# EAGLE design relaycard (EAGLE 6.2)
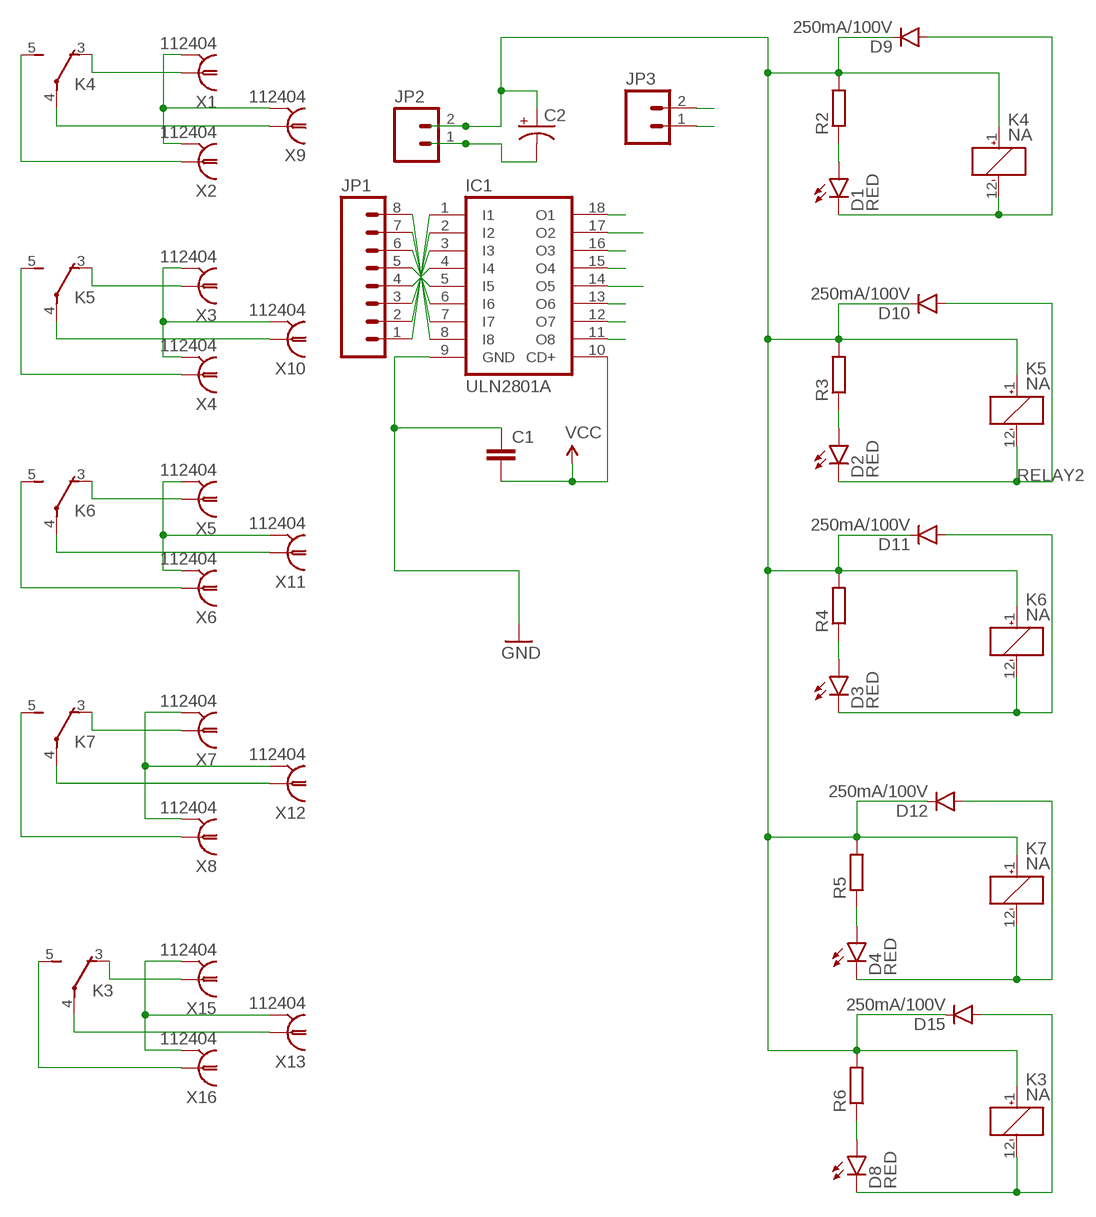
[diagram p0: schematic, sheet 1]

## Parts
C1  0.1UF-50V-20%(PTH)KIT-EZ  [CAP-PTH-SMALL-KIT]
C2  100UF-25V-20%(PTH)  [CPOL-RADIAL-100UF-25V]
D1  RED  LED-RED1206  [LED-1206]
D2  RED  LED-RED1206  [LED-1206]
D3  RED  LED-RED1206  [LED-1206]
D4  RED  LED-RED1206  [LED-1206]
D8  RED  LED-RED1206  [LED-1206]
D9  250mA/100V  DIODEBAS16  [SOD-323]
D10  250mA/100V  DIODEBAS16  [SOD-323]
D11  250mA/100V  DIODEBAS16  [SOD-323]
D12  250mA/100V  DIODEBAS16  [SOD-323]
D15  250mA/100V  DIODEBAS16  [SOD-323]
IC1  ULN2801A  [DIL18]
JP1  M08  [1X08_ROUND]
JP2  M02PTH  [1X02]
JP3  M02PTH  [1X02]
K3  NA  [NA]
K4  NA  [NA]
K5  NA  [NA]
K6  NA  [NA]
K7  NA  [NA]
R2  R-EU_R1206W  [R1206W]
R3  R-EU_R1206W  [R1206W]
R4  R-EU_R1206W  [R1206W]
R5  R-EU_R1206W  [R1206W]
R6  R-EU_R1206W  [R1206W]
X1  112404  [112404]
X2  112404  [112404]
X3  112404  [112404]
X4  112404  [112404]
X5  112404  [112404]
X6  112404  [112404]
X7  112404  [112404]
X8  112404  [112404]
X9  112404  [112404]
X10  112404  [112404]
X11  112404  [112404]
X12  112404  [112404]
X13  112404  [112404]
X15  112404  [112404]
X16  112404  [112404]

## Nets
A: D1.A R2.1
B: D2.A R3.1
C: D3.A R4.1
D: D4.A R5.1
E: D8.A R6.1
GND1: X1.2 X1.3 X1.4 X1.5 X2.2 X2.3 X2.4 X2.5 X9.2 X9.3 X9.4 X9.5
GND2: X3.2 X3.3 X3.4 X3.5 X4.2 X4.3 X4.4 X4.5 X10.2 X10.3 X10.4 X10.5
GND3: X5.2 X5.3 X5.4 X5.5 X6.2 X6.3 X6.4 X6.5 X11.2 X11.3 X11.4 X11.5
GND4: X7.2 X7.3 X7.4 X7.5 X8.2 X8.3 X8.4 X8.5 X12.2 X12.3 X12.4 X12.5
GND5: X13.2 X13.3 X13.4 X13.5 X15.2 X15.3 X15.4 X15.5 X16.2 X16.3 X16.4 X16.5
GND_V: C1.1 C2.2(-) IC1.9(GND) JP2.1 JP3.1 JP3.2 ; supply symbol labelled GND
N$1: K4.5(2:S) X2.1
N$2: IC1.1(I1) JP1.1
N$3: K4.3(2:O) X1.1
N$4: K4.4(2:P) X9.1
N$5: K5.5(2:S) X4.1
N$6: IC1.2(I2) JP1.2
N$7: K5.3(2:O) X3.1
N$8: IC1.3(I3) JP1.3
N$9: IC1.4(I4) JP1.4
N$10: IC1.5(I5) JP1.5
N$11: IC1.6(I6) JP1.6
N$12: IC1.7(I7) JP1.7
N$13: K5.4(2:P) X10.1
N$14: K6.3(2:O) X5.1
N$15: K6.5(2:S) X6.1
N$16: K6.4(2:P) X11.1
N$17: K7.3(2:O) X7.1
N$18: IC1.8(I8) JP1.8
N$19: K7.5(2:S) X8.1
N$20: K7.4(2:P) X12.1
N$21: K3.3(2:O) X15.1
N$22: K3.5(2:S) X16.1
N$23: K3.4(2:P) X13.1
RELAY1: D1.C D9.A IC1.17(O2) K4.12(1:-)
RELAY2: D2.C D10.A IC1.16(O3) K5.12(1:-)
RELAY3: D3.C D11.A IC1.15(O4) K6.12(1:-)
RELAY4: D4.C D12.A IC1.14(O5) K7.12(1:-)
RELAY5: D8.C D15.A IC1.18(O1) K3.12(1:-)
RELAY6: IC1.13(O6)
RELAY7: IC1.12(O7)
RELAY8: IC1.11(O8)
VCC: C1.2 C2.1(+) D9.C D10.C D11.C D12.C D15.C IC1.10(CD+) JP2.2 K3.1(1:+) K4.1(1:+) K5.1(1:+) K6.1(1:+) K7.1(1:+) R2.2 R3.2 R4.2 R5.2 R6.2
Unconnected: K3.8(3:S) K3.9(3:P) K3.10(3:O) K4.8(3:S) K4.9(3:P) K4.10(3:O) K5.8(3:S) K5.9(3:P) K5.10(3:O) K6.8(3:S) K6.9(3:P) K6.10(3:O) K7.8(3:S) K7.9(3:P) K7.10(3:O)

## Library data of the parts
C1 = SparkFun-Capacitors:0.1UF-50V-20%(PTH): CAP-08370; PROD_ID: CAP-08370
C2 = SparkFun-Capacitors:100UF-25V-20%(PTH): CAP-08439; PROD_ID: CAP-08439
D1-D4 D8 = SparkFun-LED:LED-RED: Assorted Red LEDs LilyPad 1206- DIO-09912 1206- DIO-00809 0603- DIO-00819 "SMART" means more efficient and expensive; PROD_ID: DIO-09912
D9-D12 D15 = SparkFun-DiscreteSemi:DIODE: Diode These are standard reverse protection diodes and small signal diodes. SMA package can handle up to about 1A. SOD-323 can handle about 200mA. What the SOD-323 package when ordering, there are some mfgs out there that are 5-pin packages.; PROD_ID: DIO-09646
IC1 = uln-udn:ULN2801A: DRIVER ARRAY
JP1 = SparkFun-Connectors:M08: Header 8 Standard 8-pin 0.1" header. Use with straight break away headers (SKU : PRT-00116), right angle break away headers (PRT-00553), swiss pins (PRT-00743), machine pins (PRT-00117), and female headers (PRT-00115).
JP2 JP3 = SparkFun-Connectors:M02: Standard 2-pin 0.1" header. Use with - straight break away headers ( PRT-00116) - right angle break away headers (PRT-00553) - swiss pins (PRT-00743) - machine pins (PRT-00117) - female headers (PRT-00115) Molex polarized connector foot print use with: PRT-08233 with associated crimp pins and housings. 2.54_SCREWTERM for use with PRT-10571. 3.5mm Screw Terminal footprints for PRT-08084 5mm Screw Terminal footprints for use with PRT-08432
K3-K7 = relay:NA: RELAY; OC_FARNELL: unknown; OC_NEWARK: unknown
R2-R6 = resistor:R-EU_: RESISTOR, European symbol
X1-X13 X15 X16 = amphenol-112404_10:112404: Amphenol Connex 112404 BNC P. C. Mount Recept. Jack Source: http://www.amphenolconnex.com/media/downloads/3157/112404.pdf; MF: Amphenol Connex; MPN: 112404; OC_FARNELL: 1583381; OC_NEWARK: 99H4363

## Board
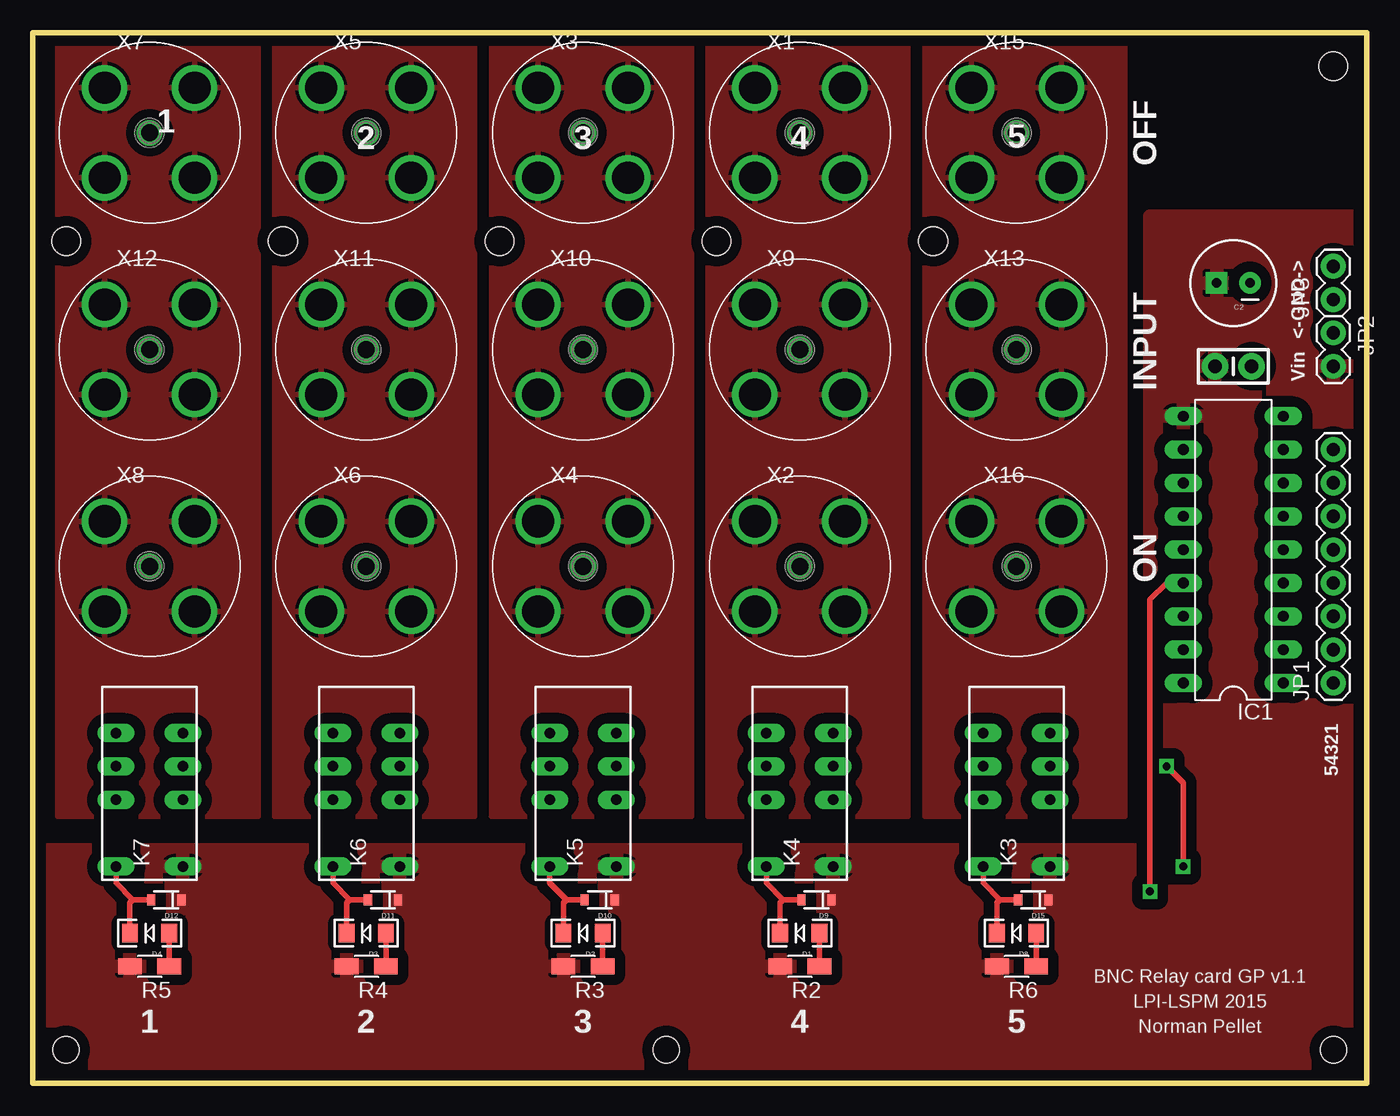
[diagram p1: board, top side]
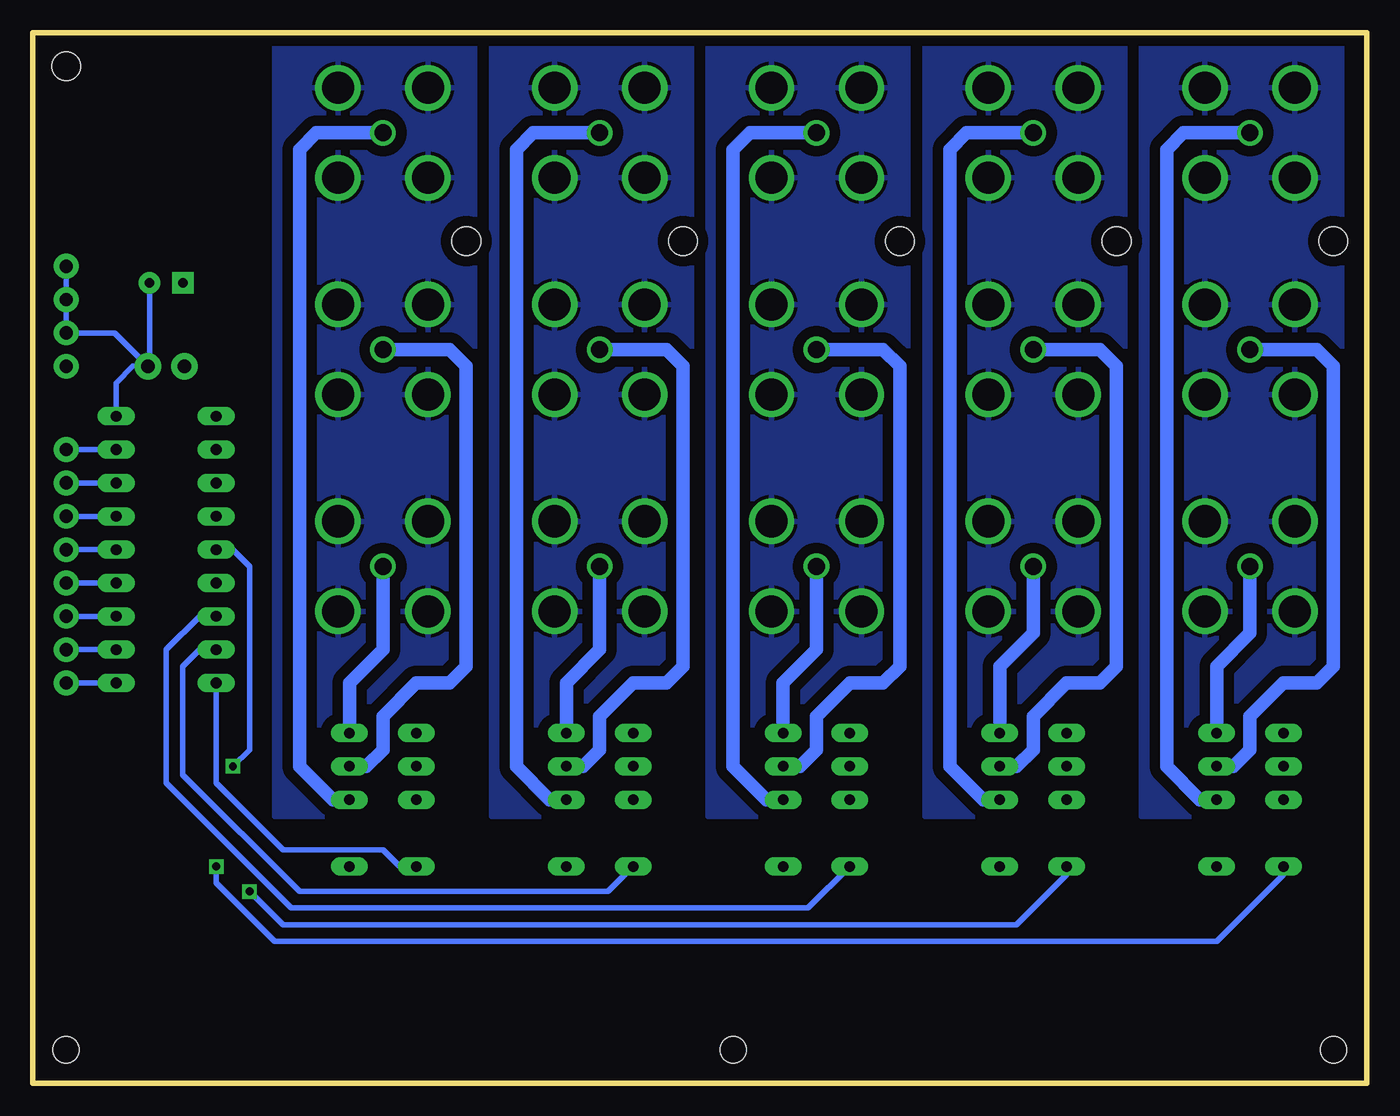
[diagram p2: board, bottom side, seen from below]

Size 101.6 x 80.01 mm. Coordinates in mm from the lower left corner, seen from the top.
Outline: 0,0 101.6,0 101.6,80.01 0,80.01 0,0
Copper layers (1*16): Top 0.035mm / dielectric 1.5mm / Bottom 0.035mm
Design rules: minimum track width 8mil, minimum drill 20mil, track to track 8mil, track to pad 8mil, pad to pad 8mil, via to via 8mil, smd to smd 8mil, copper to edge 10mil, drill to drill 8mil, minimum pad ring 12mil, minimum via ring 10mil, stop-mask expansion 4mil, vias tented up to drill 25mil, thermal gap 10mil
Holes 2.2 mm at 2.54,64.14 99.06,77.47 19.05,64.14 35.56,64.14 52.07,64.14 68.58,64.14
Holes 2 mm at 99.06,2.54 2.54,2.54 48.26,2.54

### Footprints (pad centres in the part's own frame; a part is rotated, then mirrored left to right if it is on the bottom)
CAP-PTH-SMALL-KIT = drill 1.016 pad 2.032: 1 -1.397,0; 2 1.397,0
CPOL-RADIAL-100UF-25V = drill 0.7 pad 1.651 square: 1 1.27,0 | drill 0.7 pad 1.651: 2 -1.27,0
LED-1206 = smd 1.2 x 1.4: A -1.5,0; C 1.5,0
SOD-323 = smd 0.63 x 0.83: A 1.15,0; C -1.15,0
DIL18 = drill 0.813 long: 1 -10.16,-3.81; 2 -7.62,-3.81; 3 -5.08,-3.81; 4 -2.54,-3.81; 5 0,-3.81; 6 2.54,-3.81; 7 5.08,-3.81; 8 7.62,-3.81; 9 10.16,-3.81; 10 10.16,3.81; 11 7.62,3.81; 12 5.08,3.81; 13 2.54,3.81; 14 0,3.81; 15 -2.54,3.81; 16 -5.08,3.81; 17 -7.62,3.81; 18 -10.16,3.81
1X08_ROUND = drill 1.016 pad 1.88: 1 0,0; 2 2.54,0; 3 5.08,0; 4 7.62,0; 5 10.16,0; 6 12.7,0; 7 15.24,0; 8 17.78,0
1X02 = drill 1.016 pad 1.88: 1 0,0; 2 2.54,0
NA = drill 0.8 long: 1 -6.35,-2.54; 3 -1.27,-2.54; 4 1.27,-2.54; 5 3.81,-2.54; 8 3.81,2.54; 9 1.27,2.54; 10 -1.27,2.54; 12 -6.35,2.54
R1206W = smd 1.8 x 1.2: 1 -1.499,0; 2 1.499,0
112404 = drill 1.3: 1 0,0 | drill 2.44: 2 -3.43,3.43; 3 3.43,3.43; 4 3.43,-3.43; 5 -3.43,-3.43

### Placement (x,y rotation side)
C1  91.44,54.61 180 top
C2  91.44,60.96 180 top
D1  58.42,11.43 180 top
D2  41.91,11.43 180 top
D3  25.4,11.43 180 top
D4  8.89,11.43 180 top
D8  74.93,11.43 180 top
D9  59.69,13.97 180 top
D10  43.18,13.97 180 top
D11  26.67,13.97 180 top
D12  10.16,13.97 180 top
D15  76.2,13.97 180 top
IC1  91.44,40.64 90 top
JP1  99.06,30.48 90 top
JP2  99.06,57.15 270 top
JP3  99.06,59.69 90 top
K3  74.93,22.86 90 top
K4  58.42,22.86 90 top
K5  41.91,22.86 90 top
K6  25.4,22.86 90 top
K7  8.89,22.86 90 top
R2  58.42,8.89 180 top
R3  41.91,8.89 180 top
R4  25.4,8.89 180 top
R5  8.89,8.89 180 top
R6  74.93,8.89 180 top
X1  58.42,72.39 0 top
X2  58.42,39.37 0 top
X3  41.91,72.39 0 top
X4  41.91,39.37 0 top
X5  25.4,72.39 0 top
X6  25.4,39.37 0 top
X7  8.89,72.39 0 top
X8  8.89,39.37 0 top
X9  58.42,55.88 0 top
X10  41.91,55.88 0 top
X11  25.4,55.88 0 top
X12  8.89,55.88 0 top
X13  74.93,55.88 0 top
X15  74.93,72.39 0 top
X16  74.93,39.37 0 top

### Tracks (layer width: path | path; a pad name or v marks a point on that pad's centre or on a via)
A
  Top 0.406: D1.A R2.1
B
  Top 0.406: D2.A R3.1
C
  Top 0.406: D3.A R4.1
D
  Top 0.406: D4.A R5.1
E
  Top 0.406: D8.A R6.1
GND1
  pour Bottom (isolate 0.813): 51.44,80.01 51.44,20.32 66.67,20.32 66.67,80.01
  pour Top (isolate 0.813): 51.44,80.01 51.44,20.32 66.67,20.32 66.67,80.01
GND2
  pour Bottom (isolate 0.813): 34.92,80.01 34.92,20.32 50.16,20.32 50.16,80.01
  pour Top (isolate 0.813): 34.92,80.01 34.92,20.32 50.16,20.32 50.16,80.01
GND3
  pour Bottom (isolate 0.813): 18.41,80.01 18.41,20.32 33.66,20.32 33.66,80.01
  pour Top (isolate 0.813): 18.41,80.01 18.41,20.32 33.66,20.32 33.66,80.01
GND4
  pour Bottom (isolate 0.813): 1.91,80.01 1.91,20.32 17.14,20.32 17.14,80.01
  pour Top (isolate 0.813): 1.91,80.01 1.91,20.32 17.14,20.32 17.14,80.01
GND5
  pour Bottom (isolate 0.813): 67.94,80.01 67.94,20.32 83.19,20.32 83.19,80.01
  pour Top (isolate 0.813): 67.94,80.01 67.94,20.32 83.19,20.32 83.19,80.01
GND_V
  Bottom 0.406: C2.2 92.71,54.74 C1.1 | C1.1 93.98,54.61 95.25,53.34 IC1.9 | C1.1 95.38,57.15 JP2.1 JP3.1 JP3.2
N$1
  Bottom 1.016: K4.5 60.96,30.48 58.42,33.02 X2.1
N$2
  Bottom 0.406: IC1.1 JP1.1
N$3
  Bottom 1.016: K4.3 62.23,21.59 64.77,24.13 64.77,71.12 63.5,72.39 X1.1
N$4
  Bottom 1.016: K4.4 59.69,24.13 58.42,25.4 58.42,27.94 55.88,30.48 53.34,30.48 52.07,31.75 52.07,54.61 53.34,55.88 X9.1
N$5
  Bottom 1.016: K5.5 44.45,30.48 41.91,33.02 X4.1
N$6
  Bottom 0.406: JP1.2 IC1.2
N$7
  Bottom 1.016: K5.3 45.72,21.59 48.26,24.13 48.26,71.12 46.99,72.39 X3.1
N$8
  Bottom 0.406: JP1.3 IC1.3
N$9
  Bottom 0.406: JP1.4 IC1.4
N$10
  Bottom 0.406: JP1.5 IC1.5
N$11
  Bottom 0.406: JP1.6 IC1.6
N$12
  Bottom 0.406: JP1.7 IC1.7
N$13
  Bottom 1.016: K5.4 43.18,24.13 41.91,25.4 41.91,27.94 39.37,30.48 36.83,30.48 35.56,31.75 35.56,54.61 36.83,55.88 X10.1
N$14
  Bottom 1.016: K6.3 29.21,21.59 31.75,24.13 31.75,71.12 30.48,72.39 X5.1
N$15
  Bottom 1.016: K6.5 27.94,31.75 25.4,34.29 X6.1
N$16
  Bottom 1.016: X11.1 20.32,55.88 19.05,54.61 19.05,31.75 20.32,30.48 22.86,30.48 25.4,27.94 25.4,25.4 26.67,24.13 K6.4
N$17
  Bottom 1.016: K7.3 12.7,21.59 15.24,24.13 15.24,71.12 13.97,72.39 X7.1
N$18
  Bottom 0.406: JP1.8 IC1.8
N$19
  Bottom 1.016: K7.5 11.43,31.75 8.89,34.29 X8.1
N$20
  Bottom 1.016: K7.4 10.16,24.13 8.89,25.4 8.89,27.94 6.35,30.48 3.81,30.48 2.54,31.75 2.54,54.61 3.81,55.88 X12.1
N$21
  Bottom 1.016: K3.3 78.74,21.59 81.28,24.13 81.28,71.12 80.01,72.39 X15.1
N$22
  Bottom 1.016: K3.5 77.47,30.48 74.93,33.02 X16.1
N$23
  Bottom 1.016: K3.4 76.2,24.13 74.93,25.4 74.93,27.94 72.39,30.48 69.85,30.48 68.58,31.75 68.58,54.61 69.85,55.88 X13.1
RELAY1
  Top 0.406: D1.C 56.92,13.74 57.15,13.97 | 57.15,13.97 D9.A | K4.12 55.88,15.24 57.15,13.97
  Bottom 0.406: IC1.17 88.9,33.02 90.17,31.75 90.17,23.5 81.28,14.61 57.78,14.61 K4.12
RELAY2
  Top 0.406: 40.64,13.97 39.37,15.24 K5.12 | D2.C 40.41,13.74 40.64,13.97 | 40.64,13.97 D10.A
  Bottom 0.406: IC1.16 88.9,35.56 91.44,33.02 91.44,22.86 81.92,13.34 42.55,13.34 K5.12
RELAY3  (via drill 0.6)
  Top 0.406: K6.12 22.86,15.24 24.13,13.97 | 24.13,13.97 D11.A | D3.C 23.9,13.74 24.13,13.97 | IC1.15 86.36,38.1 85.09,36.83 v85.09,14.61
  Bottom 0.406: v85.09,14.61 82.55,12.06 26.67,12.06 22.86,15.88 K6.12
RELAY4  (via drill 0.6)
  Top 0.406: K7.12 6.35,15.24 7.62,13.97 | 7.62,13.97 D12.A | D4.C 7.39,13.74 7.62,13.97 | v86.36,24.13 87.63,22.86 v87.63,16.51
  Bottom 0.406: IC1.14 86.36,40.64 85.09,39.37 85.09,25.4 v86.36,24.13 | v87.63,16.51 87.63,15.24 83.19,10.79 11.43,10.79 6.35,15.88 K7.12
RELAY5
  Top 0.406: 73.66,13.97 72.39,15.24 K3.12 | 73.66,13.97 D15.A | D8.C 73.43,13.74 73.66,13.97
  Bottom 0.406: K3.12 73.66,16.51 74.93,17.78 82.55,17.78 87.63,22.86 IC1.18
VCC
  pour Top (isolate 0.813): 0,17.78 0,0 101.6,0 101.6,17.78
  pour Top (isolate 0.813): 85.09,-43.18 102.87,-43.18 102.87,66.04 85.09,66.04

### Text on the board
tPlace: 5 | 1 | OFF | 2 | 3 | 4 | <-GND-> | INPUT | Vin | ON | 54321 | BNC Relay card GP v1.1 | LPI-LSPM 2015 | 1 | 2 | 3 | 4 | 5 | Norman Pellet